# Altium schematic sheet MCU.SchDoc: Arm - Microcontroller
size Letter; DrawnBy: P.Onaifo; Organization: UW Robotics; Address1: 200 University Avenue; Address2: Waterloo; Address3: Ontario; Address4: Canada N2L 3G6; SheetNumber: 4; SheetTotal: 9
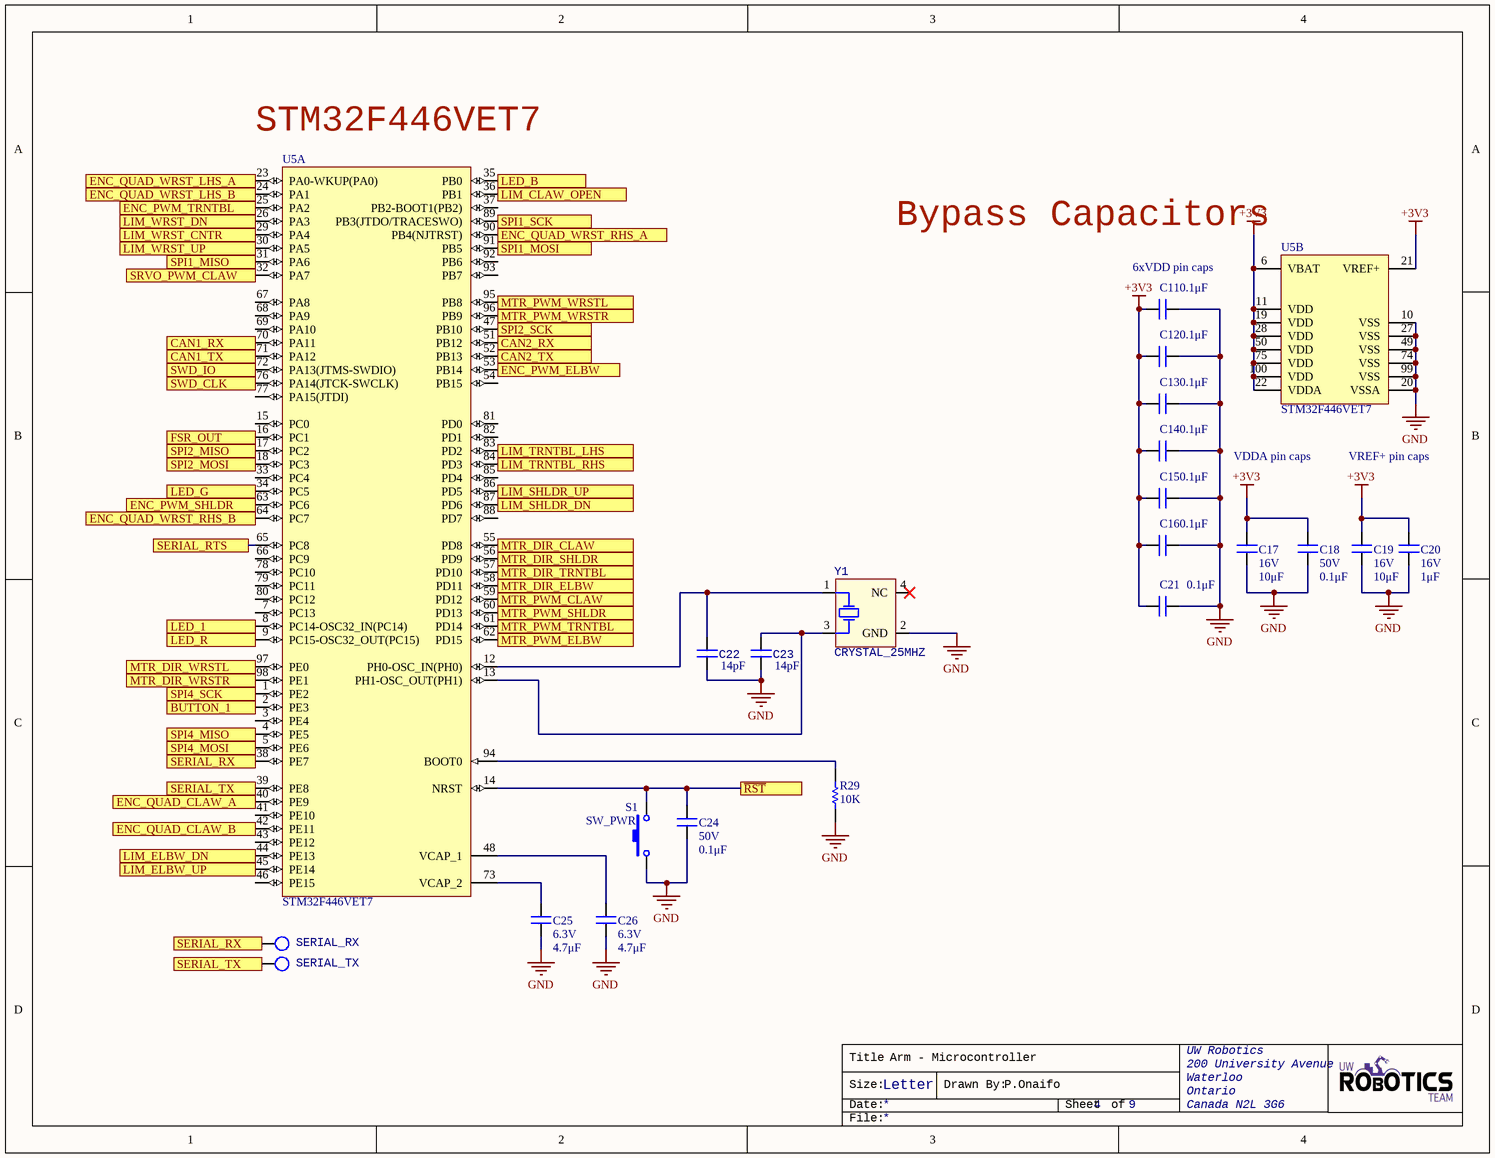
[diagram p0: MCU.SchDoc]

## Parts
C11  value 0.1μF  [CAPC0603(1608)55_N]  (hidden comment: CAP_0.1uF_50V_0603)
C12  value 0.1μF  [CAPC0603(1608)55_N]  (hidden comment: CAP_0.1uF_50V_0603)
C13  value 0.1μF  [CAPC0603(1608)55_N]  (hidden comment: CAP_0.1uF_50V_0603)
C14  value 0.1μF  [CAPC0603(1608)55_N]  (hidden comment: CAP_0.1uF_50V_0603)
C15  value 0.1μF  [CAPC0603(1608)55_N]  (hidden comment: CAP_0.1uF_50V_0603)
C16  value 0.1μF  [CAPC0603(1608)55_N]  (hidden comment: CAP_0.1uF_50V_0603)
C17  value 10μF  Voltage Rating: 16V  [CAPC0603(1608)55_N]  (hidden comment: CAP_10nF_0603)
C18  value 0.1μF  Voltage Rating: 50V  [CAPC0603(1608)55_N]  (hidden comment: CAP_0.1uF_50V_0603)
C19  value 10μF  Voltage Rating: 16V  [CAPC0603(1608)55_N]  (hidden comment: CAP_10nF_0603)
C20  value 1μF  Voltage Rating: 16V  [CAPC0603(1608)55_N]  (hidden comment: CAP_1uF_16V_0603)
C21  value 0.1μF  [CAPC0603(1608)55_N]  (hidden comment: CAP_0.1uF_50V_0603)
C22  value 14pF  (hidden comment: CAP_14pF_50V_0603)
C23  value 14pF  (hidden comment: CAP_14pF_50V_0603)
C24  value 0.1μF  Voltage Rating: 50V  [CAPC0603(1608)55_N]  (hidden comment: CAP_0.1uF_50V_0603)
C25  value 4.7μF  Voltage Rating: 6.3V  [CAPC0603(1608)55_N]  (hidden comment: CAP_4.7uF_0603)
C26  value 4.7μF  Voltage Rating: 6.3V  [CAPC0603(1608)55_N]  (hidden comment: CAP_4.7uF_0603)
R29  value 10K  [RESC0603(1608)_N]  (hidden comment: RES_10K_0603)
S1  SW_PWR  [PTS830GM140]
SERIAL_RX  TESTPOINT_LOOP  [TESTPOINT_LOOP]  (value not drawn)
SERIAL_TX  TESTPOINT_LOOP  [TESTPOINT_LOOP]  (value not drawn)
U5  STM32F446VET7  [STM-LQFP100_L]  (parts A,B of 2)
Y1  CRYSTAL_25MHZ  [SOIC254P1016X440-4N]

## Ports
BUTTON_1, CAN1_RX, CAN1_TX, CAN2_RX, CAN2_TX, ENC_PWM_ELBW, ENC_PWM_SHLDR, ENC_PWM_TRNTBL, ENC_QUAD_CLAW_A, ENC_QUAD_CLAW_B, ENC_QUAD_WRST_LHS_A, ENC_QUAD_WRST_LHS_B, ENC_QUAD_WRST_RHS_A, ENC_QUAD_WRST_RHS_B, FSR_OUT, LED_1, LED_B, LED_G, LED_R, LIM_CLAW_OPEN, LIM_ELBW_DN, LIM_ELBW_UP, LIM_SHLDR_DN, LIM_SHLDR_UP, LIM_TRNTBL_LHS, LIM_TRNTBL_RHS, LIM_WRST_CNTR, LIM_WRST_DN, LIM_WRST_UP, MTR_DIR_CLAW, MTR_DIR_ELBW, MTR_DIR_SHLDR, MTR_DIR_TRNTBL, MTR_DIR_WRSTL, MTR_DIR_WRSTR, MTR_PWM_CLAW, MTR_PWM_ELBW, MTR_PWM_SHLDR, MTR_PWM_TRNTBL, MTR_PWM_WRSTL, MTR_PWM_WRSTR, SERIAL_RTS, SERIAL_RX, SERIAL_TX, SPI1_MISO, SPI1_MOSI, SPI1_SCK, SPI2_MISO, SPI2_MOSI, SPI2_SCK, SPI4_MISO, SPI4_MOSI, SPI4_SCK, SRVO_PWM_CLAW, SWD_CLK, SWD_IO, ~{RST}

## Nets
+3V3: C11.1 C12.1 C13.1 C14.1 C15.1 C16.1 C17.2 C18.2 C19.1 C20.2 C21.1 U5.6(VBAT) U5.11(VDD) U5.19(VDD) U5.21(VREF+) U5.22(VDDA) U5.28(VDD) U5.50(VDD) U5.75(VDD) U5.100(VDD)
GND: C11.2 C12.2 C13.2 C14.2 C15.2 C16.2 C17.1 C18.1 C19.2 C20.1 C21.2 C22.1 C23.1 C24.1 C25.1 C26.1 R29.2 S1.1 U5.10(VSS) U5.20(VSSA) U5.27(VSS) U5.49(VSS) U5.74(VSS) U5.99(VSS) Y1.2(GND)
~{RST}: C24.2 S1.2 U5.14(NRST) ; port ~{RST}
BUTTON_1: U5.2(PE3) ; port BUTTON_1
CAN1_RX: U5.70(PA11) ; port CAN1_RX
CAN1_TX: U5.71(PA12) ; port CAN1_TX
CAN2_RX: U5.51(PB12) ; port CAN2_RX
CAN2_TX: U5.52(PB13) ; port CAN2_TX
ENC_PWM_ELBW: U5.53(PB14) ; port ENC_PWM_ELBW
ENC_PWM_SHLDR: U5.63(PC6) ; port ENC_PWM_SHLDR
ENC_PWM_TRNTBL: U5.25(PA2) ; port ENC_PWM_TRNTBL
ENC_QUAD_CLAW_A: U5.40(PE9) ; port ENC_QUAD_CLAW_A
ENC_QUAD_CLAW_B: U5.42(PE11) ; port ENC_QUAD_CLAW_B
ENC_QUAD_WRST_LHS_A: U5.23(PA0-WKUP(PA0)) ; port ENC_QUAD_WRST_LHS_A
ENC_QUAD_WRST_LHS_B: U5.24(PA1) ; port ENC_QUAD_WRST_LHS_B
ENC_QUAD_WRST_RHS_A: U5.90(PB4(NJTRST)) ; port ENC_QUAD_WRST_RHS_A
ENC_QUAD_WRST_RHS_B: U5.64(PC7) ; port ENC_QUAD_WRST_RHS_B
FSR_OUT: U5.16(PC1) ; port FSR_OUT
LED_1: U5.8(PC14-OSC32_IN(PC14)) ; port LED_1
LED_B: U5.35(PB0) ; port LED_B
LED_G: U5.34(PC5) ; port LED_G
LED_R: U5.9(PC15-OSC32_OUT(PC15)) ; port LED_R
LIM_CLAW_OPEN: U5.36(PB1) ; port LIM_CLAW_OPEN
LIM_ELBW_DN: U5.44(PE13) ; port LIM_ELBW_DN
LIM_ELBW_UP: U5.45(PE14) ; port LIM_ELBW_UP
LIM_SHLDR_DN: U5.87(PD6) ; port LIM_SHLDR_DN
LIM_SHLDR_UP: U5.86(PD5) ; port LIM_SHLDR_UP
LIM_TRNTBL_LHS: U5.83(PD2) ; port LIM_TRNTBL_LHS
LIM_TRNTBL_RHS: U5.84(PD3) ; port LIM_TRNTBL_RHS
LIM_WRST_CNTR: U5.29(PA4) ; port LIM_WRST_CNTR
LIM_WRST_DN: U5.26(PA3) ; port LIM_WRST_DN
LIM_WRST_UP: U5.30(PA5) ; port LIM_WRST_UP
MTR_DIR_CLAW: U5.55(PD8) ; port MTR_DIR_CLAW
MTR_DIR_ELBW: U5.58(PD11) ; port MTR_DIR_ELBW
MTR_DIR_SHLDR: U5.56(PD9) ; port MTR_DIR_SHLDR
MTR_DIR_TRNTBL: U5.57(PD10) ; port MTR_DIR_TRNTBL
MTR_DIR_WRSTL: U5.97(PE0) ; port MTR_DIR_WRSTL
MTR_DIR_WRSTR: U5.98(PE1) ; port MTR_DIR_WRSTR
MTR_PWM_CLAW: U5.59(PD12) ; port MTR_PWM_CLAW
MTR_PWM_ELBW: U5.62(PD15) ; port MTR_PWM_ELBW
MTR_PWM_SHLDR: U5.60(PD13) ; port MTR_PWM_SHLDR
MTR_PWM_TRNTBL: U5.61(PD14) ; port MTR_PWM_TRNTBL
MTR_PWM_WRSTL: U5.95(PB8) ; port MTR_PWM_WRSTL
MTR_PWM_WRSTR: U5.96(PB9) ; port MTR_PWM_WRSTR
SERIAL_RTS: U5.65(PC8) ; port SERIAL_RTS
SERIAL_RX: SERIAL_RX.1 U5.38(PE7) ; port SERIAL_RX
SERIAL_TX: SERIAL_TX.1 U5.39(PE8) ; port SERIAL_TX
SPI1_MISO: U5.31(PA6) ; port SPI1_MISO
SPI1_MOSI: U5.91(PB5) ; port SPI1_MOSI
SPI1_SCK: U5.89(PB3(JTDO/TRACESWO)) ; port SPI1_SCK
SPI2_MISO: U5.17(PC2) ; port SPI2_MISO
SPI2_MOSI: U5.18(PC3) ; port SPI2_MOSI
SPI2_SCK: U5.47(PB10) ; port SPI2_SCK
SPI4_MISO: U5.4(PE5) ; port SPI4_MISO
SPI4_MOSI: U5.5(PE6) ; port SPI4_MOSI
SPI4_SCK: U5.1(PE2) ; port SPI4_SCK
SRVO_PWM_CLAW: U5.32(PA7) ; port SRVO_PWM_CLAW
SWD_CLK: U5.76(PA14(JTCK-SWCLK)) ; port SWD_CLK
SWD_IO: U5.72(PA13(JTMS-SWDIO)) ; port SWD_IO
NetC22_2: C22.2 U5.12(PH0-OSC_IN(PH0)) Y1.1(HOT)
NetC23_2: C23.2 U5.13(PH1-OSC_OUT(PH1)) Y1.3(HOT)
NetC25_2: C25.2 U5.73(VCAP_2)
NetC26_2: C26.2 U5.48(VCAP_1)
NetR29_1: R29.1 U5.94(BOOT0)

Not connected (* = marked no-connect by the designer): U5 3(PE4) 7(PC13) 15(PC0) 33(PC4) 37(PB2-BOOT1(PB2)) 41(PE10) 43(PE12) 46(PE15) 54(PB15) 66(PC9) 67(PA8) 68(PA9) 69(PA10) 77(PA15(JTDI)) 78(PC10) 79(PC11) 80(PC12) 81(PD0) 82(PD1) 85(PD4) 88(PD7) 92(PB6) 93(PB7); Y1 4(NC)*

## Notes on the sheet
- (near U5) STM32F446VET7
- Bypass Capacitors
- (near C11) 6xVDD pin caps
- VDDA pin caps
- VREF+ pin caps
- Title
- Size:
- Date:
- Letter
- Drawn By:
- Sheet
- of
- File:

## Library data of the parts
C11-C16 C18 C21 C24 = CAP_0.1uF_50V_0603: CAP CER 0.1UF 50V X7R 0603; Manufacturer Part Number 1: CC0603KRX7R9BB104; Manufacturer 1: Yageo; Dimensions: 0.063" L x 0.031" W (1.60mm x 0.80mm); Package: 0603 (1608 Metric); Temperature Coefficient: X7R; Supplier Part Number 1: 311-1344-1-ND; Supplier 1: Digi-Key; Mount: Surface Mount; Case Code (Imperial): 0603; Case Code (Metric): 1608; Dielectric: X7R
  C11-C16 C21: Voltage Rating: 50V
C17 C19 = CAP_10nF_0603: CAP CER 10000PF 16V X7R 0603; Manufacturer Part Number 1: CC0603KRX7R7BB103; Manufacturer 1: Yageo; Dimensions: 0.063" L x 0.031" W (1.60mm x 0.80mm); Package: 0603 (1608 Metric); Temperature Coefficient: X7R; Supplier Part Number 1: 311-3369-1-ND; Supplier 1: Digi-Key; Mount: Surface Mount; Case Code (Imperial): 0603; Case Code (Metric): 1608; Dielectric: X7R
C20 = CAP_1uF_16V_0603: CAP CER 1UF 16V Y5V 0603; Manufacturer Part Number: CC0603ZRY5V7BB105; Manufacturer 1: Yageo; Dimensions: 0.063" L x 0.031" W (1.60mm x 0.80mm); Package: 0603 (1608 Metric); Temperature Coefficient: Y5V; Supplier Part Number 1: 311-1372-1-ND; Supplier 1: Digi-Key; Mount: Surface Mount; Case Code (Imperial): 0603; Case Code (Metric): 1608; Manufacturer Part Number 1: CC0603ZRY5V7BB105; Dielectric: Y5V
C22 C23 = CAP_14pF_50V_0603: CAP CER 14PF 50V C0G/NP0 0603; Manufacturer 1: Samsung; Manufacturer Part Number 1: CL10C140JB8NNNC; Tolerance: 5%; Dielectric: C0G, NP0; Voltage Rating: 50V; Supplier Part Number 1: 1276-2187-1-ND; Supplier 1: Digi-Key; Stock 1: 187088; Pricing 1: 1=0.10000, 10=0.06700, 100=0.02980, 500=0.02130, 1000=0.01673 (USD); RoHS: Yes; Mount: Surface Mount; Case Code (Metric): 1608; Case Code (Imperial): 0603; Min Operating Temperature: -55°C; Max Operating Temperature: 125°C; Package Quantity: 1; Packaging: Tape and Reel; Voltage Rating (DC): 50V; Length: 1.6mm; Height: 0.8mm; Width: 0.031inch; Depth: 0.8mm; Thickness: 0.035inch; Radiation Hardening: No; ComponentLink1URL: https://datasheet.ciiva.com/25782/cl10c140jb8nnnc-25782947.pdf?src-supplier=Digi-Key; ComponentLink1Description: https://datasheet.ciiva.com/25782/cl10c140jb8nnnc-25782947.pdf?src-supplier=Digi-Key; Package: 0603 (1608 Metric)
C25 C26 = CAP_4.7uF_0603: CAP CER 4.7UF 6.3V X5R 0603; Manufacturer Part Number 1: CC0603KRX5R5BB475; Manufacturer 1: Yageo; Dimensions: 0.063" L x 0.031" W (1.60mm x 0.80mm); Package: 0603 (1608 Metric); Temperature Coefficient: X5R; Supplier Part Number 1: 311-1521-1-ND; Supplier 1: Digi-Key; Mount: Surface Mount; Case Code (Imperial): 0603; Case Code (Metric): 1608; Dielectric: X5R
R29 = RES_10K_0603: RES SMD 10K OHM 5% 1/10W 0603; Manufacturer: Yageo; MPN: RC0603JR-0710KL; Package: 0603 (1608 Metric); Dimensions: 0.063" L x 0.031" W (1.60mm x 0.80mm); Tolerance: 5%; Supplier Part Number 1: 311-10KGRCT-ND; Supplier 1: Digi-Key
S1 = SW_PWR: Power Switch (Red); pin to pad: 2>4; Manufacturer Part Number 1: PTS830GM140 SMTR LFS; Manufacturer 1: C&K; ComponentLink1Description: Datasheet; ComponentLink1URL: https://www.ckswitches.com/media/1478/pts830.pdf; Supplier Part Number 1: CKN10587CT-ND; Supplier 1: Digi-Key; Mount: Surface Mount
SERIAL_RX SERIAL_TX = TESTPOINT_LOOP: Loop testpoint through-hole pad; Manufacturer Part Number 1: 5002; Manufacturer 1: Keystone Electronics; Supplier Part Number 1: 36-5002-ND; Supplier 1: Digi-Key; Mount: Through Hole
U5 = CMP-0243-00221-1: ARM Cortex-M4 32-bit MCU+FPU, 512 KB Flash, 128 KB Internal RAM, 81 I/Os, 100-Pin LQFP, -40 to 105 degC, Tray; Supply Voltage(Vcc) min (V): 1.7; Operating Frequency(F) (Processor speed) (MHz): 180; D/A Converter: 2; FLASH Size (Prog) (kB): 512; I/Os (High Current): 81; Internal RAM Size (kB): 128; Core: ARM Cortex-M4; Packing: Tray; ComponentLink1URL: http://www.st.com/; DatasheetVersion: Rev. 6; Mounting Technology: Surface Mount; ComponentLink2Description: Datasheet; ComponentLink2URL: http://www.st.com/st-web-ui/static/active/en/resource/technical/document/datasheet/DM00141306.pdf; Package Reference: 100-Pin Low Profile Quad Flat Package, Body 14 x 14 mm, Pitch 0.5 mm; ComponentLink1Description: Manufacturer URL; Package Description: LQFP100
Y1 = CRYSTAL_25MHZ: CRYSTAL 25.0000MHZ 12PF SMD; Manufacturer 1: Kyocera AVX; Manufacturer Part Number 1: CX2520DB25000H0FLJC1; Frequency: 25MHz; ESR (Equivalent Series Resistance): 80R; Frequency Stability: 15ppm; Frequency Tolerance: 10ppm; ComponentLink1Description: https://media.digikey.com/pdf/Data%20Sheets/AVX%20PDFs/CX2520DB_USY1M-H1-16429-00_Spec.pdf?src-supplier=Digi-Key; ComponentLink1URL: https://media.digikey.com/pdf/Data%20Sheets/AVX%20PDFs/CX2520DB_USY1M-H1-16429-00_Spec.pdf?src-supplier=Digi-Key; Supplier 1: Digi-Key; Supplier Part Number 1: 1253-1724-1-ND; Stock 1: 11741; Pricing 1: 1=0.72000, 10=0.63300, 50=0.59120, 100=0.52250, 500=0.49500, 1000=0.41250 (USD); RoHS: Yes; Mount: Surface Mount; Case/Package: SMD/SMT; Min Operating Temperature: -30°C; Max Operating Temperature: 85°C; Packaging: Tape and Reel; Load Capacitance: 12pF; Length: 0.098inch; Height: 0.022inch; Width: 0.079inch; Ratings: AEC-Q200